# EAGLE schematic Wasp (EAGLE 6.5.0)
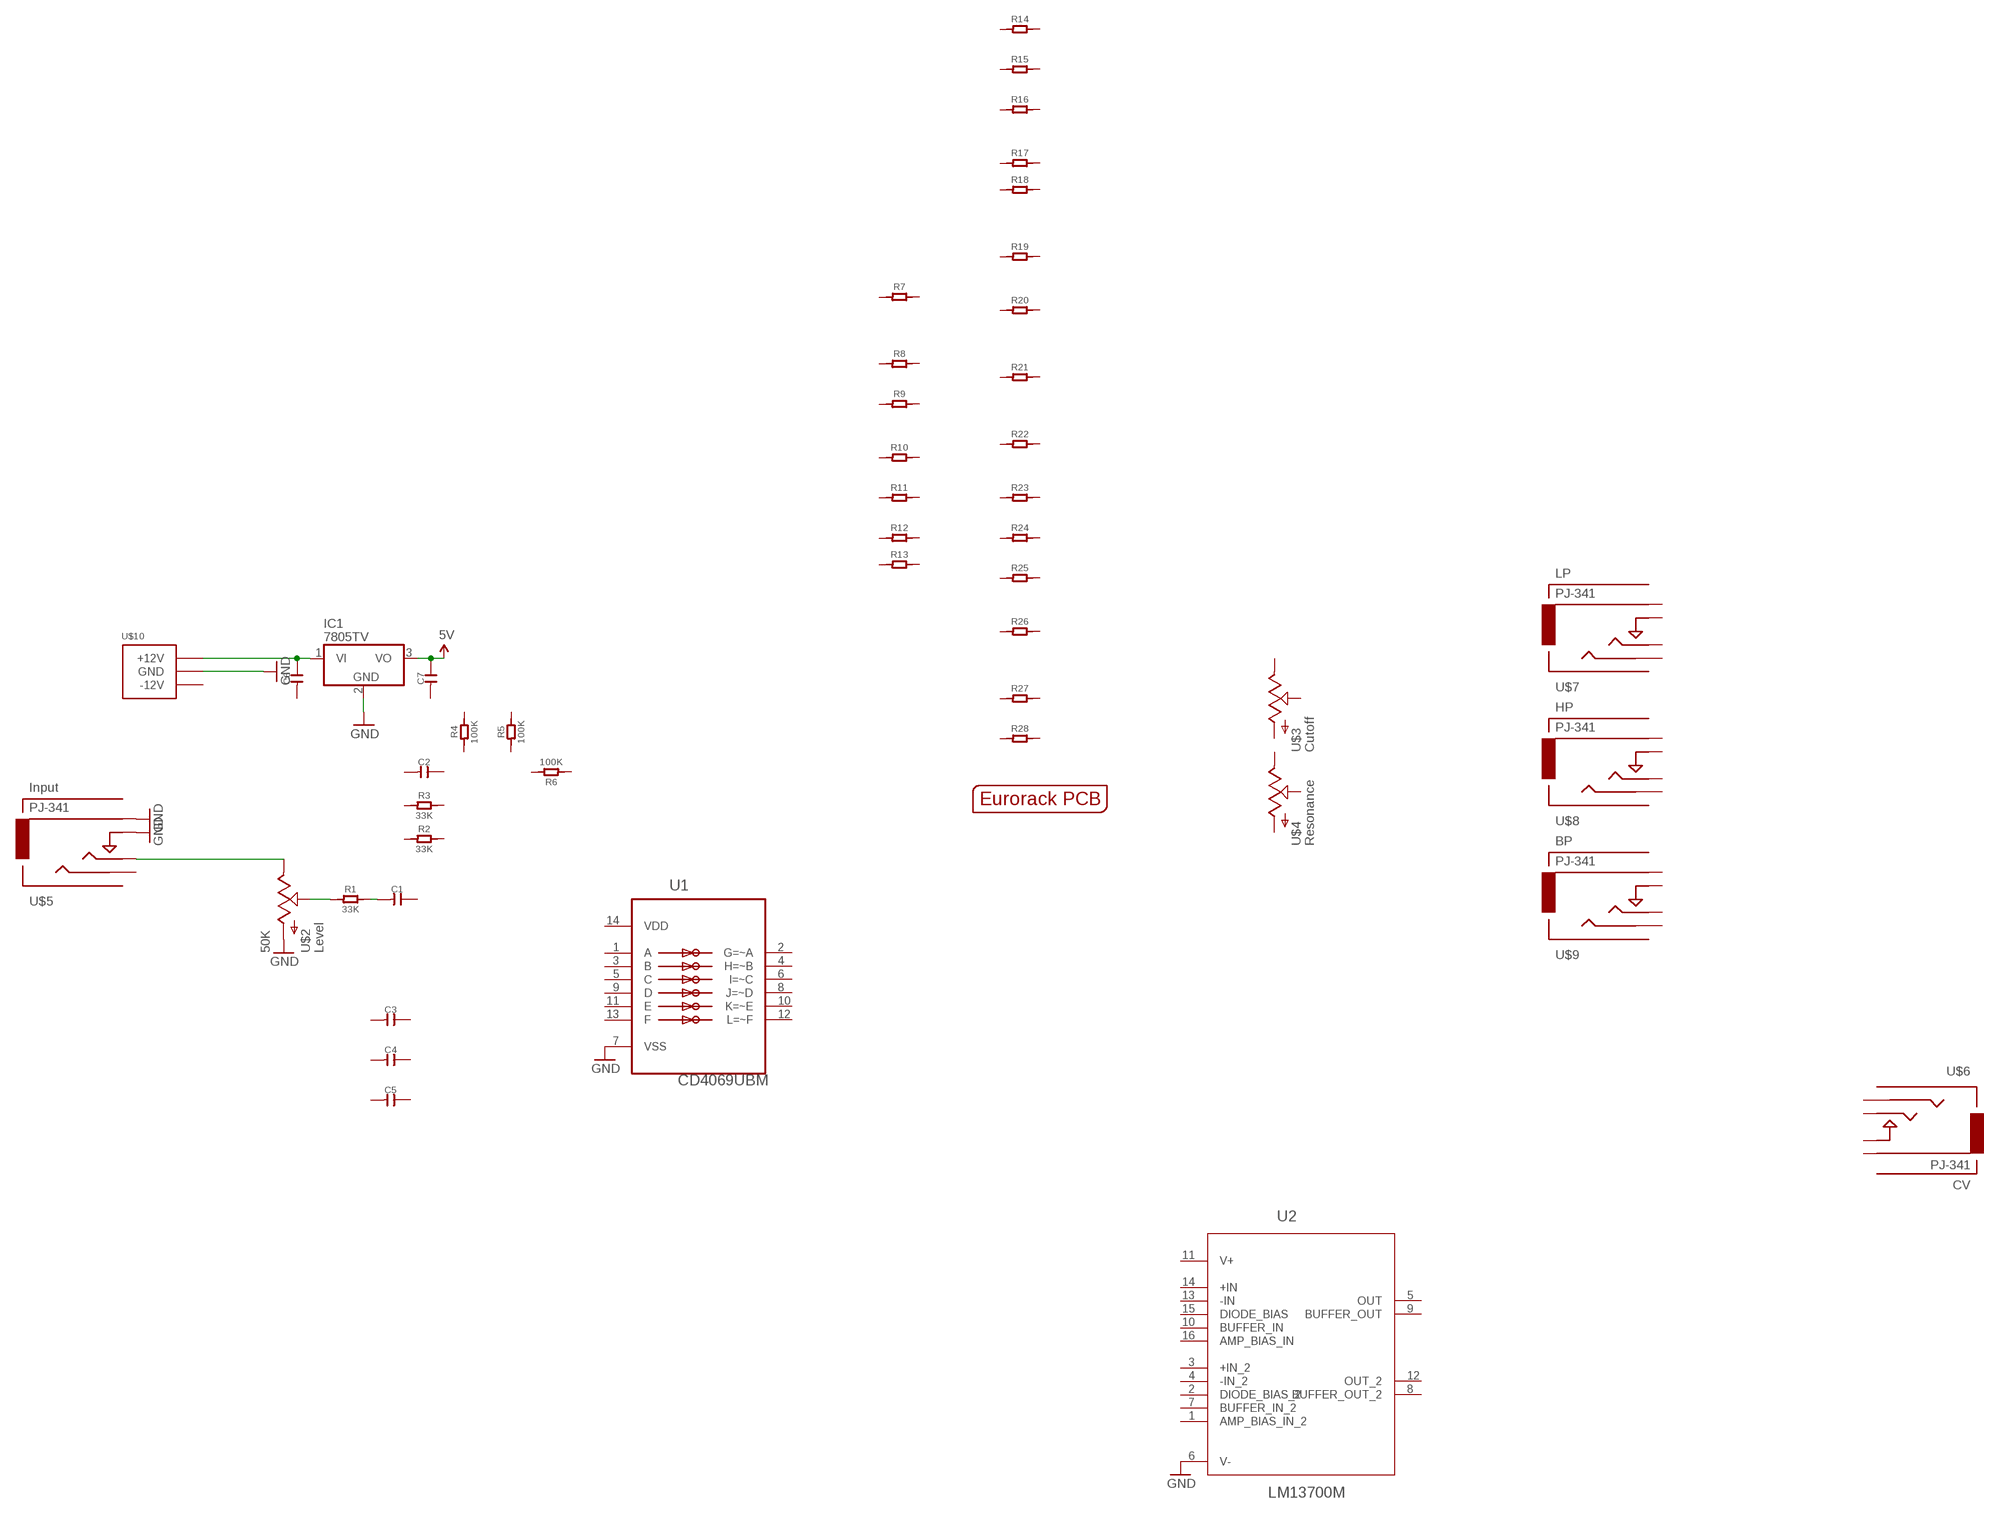
[diagram p0: schematic, sheet 1]

## Parts
C1  C-0603  [C0603]
C2  C-0603  [C0603]
C3  C-0603  [C0603]
C4  C-0603  [C0603]
C5  C-0603  [C0603]
C6  C-0603  [C0603]
C7  C-0603  [C0603]
IC1  7805TV  [TO220V]
R1  33K  R-0603  [R0603]
R2  33K  R-0603  [R0603]
R3  33K  R-0603  [R0603]
R4  100K  R-0603  [R0603]
R5  100K  R-0603  [R0603]
R6  100K  R-0603  [R0603]
R7  R-0603  [R0603]
R8  R-0603  [R0603]
R9  R-0603  [R0603]
R10  R-0603  [R0603]
R11  R-0603  [R0603]
R12  R-0603  [R0603]
R13  R-0603  [R0603]
R14  R-0603  [R0603]
R15  R-0603  [R0603]
R16  R-0603  [R0603]
R17  R-0603  [R0603]
R18  R-0603  [R0603]
R19  R-0603  [R0603]
R20  R-0603  [R0603]
R21  R-0603  [R0603]
R22  R-0603  [R0603]
R23  R-0603  [R0603]
R24  R-0603  [R0603]
R25  R-0603  [R0603]
R26  R-0603  [R0603]
R27  R-0603  [R0603]
R28  R-0603  [R0603]
U1  CD4069UBM  [SOIC127P600X175-14N]
U2  LM13700M  [SOIC127P620X175-16N]
U$1  EURORACK_PCB4HP  [EURORACK4HPPCB]
U$2  50K  POTZEPHPOT  [OG-POTS_ALPS_POT_VERTICAL]
U$3  POTZEPHPOT  [OG-POTS_ALPS_POT_VERTICAL]
U$4  POTZEPHPOT  [OG-POTS_ALPS_POT_VERTICAL]
U$5  PJ-341  AUDIO-JACKINPUT  [3.5MM-JACK-SWITCH-13MM-INPUT]
U$6  PJ-341  AUDIO-JACKINPUT  [3.5MM-JACK-SWITCH-13MM-INPUT]
U$7  PJ-341  AUDIO-JACKOUTPUT  [3.5MM-JACK-SWITCH-13MM-OUTPUT]
U$8  PJ-341  AUDIO-JACKOUTPUT  [3.5MM-JACK-SWITCH-13MM-OUTPUT]
U$9  PJ-341  AUDIO-JACKOUTPUT  [3.5MM-JACK-SWITCH-13MM-OUTPUT]
U$10  POWER_SIMPLE10  [POWER_10]

## Nets
5V: C7.2 IC1.3(VO)
GND: IC1.2(GND) U1.7(VSS) U2.6(V-) U$2.P$3(A) U$5.RING@3(RING) U$5.SWITCH@3(SWITCH) U$10.3(GND) U$10.4(GND) U$10.5(GND) U$10.6(GND) U$10.7(GND) U$10.8(GND)
N$1: R1.1 U$2.P$2(S)
N$2: U$2.P$1(E) U$5.TIP@3(TIP)
N$3: C6.2 IC1.1(VI) U$10.9(+12V) U$10.10(+12V)
N$4: C1.1 R1.2
Unconnected: C1.2 C2.1 C2.2 C3.1 C3.2 C4.1 C4.2 C5.1 C5.2 C6.1 C7.1 R2.1 R2.2 R3.1 R3.2 R4.1 R4.2 R5.1 R5.2 R6.1 R6.2 R7.1 R7.2 R8.1 R8.2 R9.1 R9.2 R10.1 R10.2 R11.1 R11.2 R12.1 R12.2 R13.1 R13.2 R14.1 R14.2 R15.1 R15.2 R16.1 R16.2 R17.1 R17.2 R18.1 R18.2 R19.1 R19.2 R20.1 R20.2 R21.1 R21.2 R22.1 R22.2 R23.1 R23.2 R24.1 R24.2 R25.1 R25.2 R26.1 R26.2 R27.1 R27.2 R28.1 R28.2 U1.1(A) U1.2(G=~A) U1.3(B) U1.4(H=~B) U1.5(C) U1.6(I=~C) U1.8(J=~D) U1.9(D) U1.10(K=~E) U1.11(E) U1.12(L=~F) U1.13(F) U2.1(AMP_BIAS_IN_2) U2.2(DIODE_BIAS_2) U2.3(+IN_2) U2.4(-IN_2) U2.5(OUT) U2.7(BUFFER_IN_2) U2.8(BUFFER_OUT_2) U2.9(BUFFER_OUT) U2.10(BUFFER_IN) U2.12(OUT_2) U2.13(-IN) U2.14(+IN) U2.15(DIODE_BIAS) U2.16(AMP_BIAS_IN) U$3.P$1(E) U$3.P$2(S) U$3.P$3(A) U$4.P$1(E) U$4.P$2(S) U$4.P$3(A) U$5.SECOND@3(SECOND) U$6.RING@3(RING) U$6.SECOND@3(SECOND) U$6.SWITCH@3(SWITCH) U$6.TIP@3(TIP) U$7.RING@3(RING) U$7.SECOND@3(SECOND) U$7.SWITCH@3(SWITCH) U$7.TIP@3(TIP) U$8.RING@3(RING) U$8.SECOND@3(SECOND) U$8.SWITCH@3(SWITCH) U$8.TIP@3(TIP) U$9.RING@3(RING) U$9.SECOND@3(SECOND) U$9.SWITCH@3(SWITCH) U$9.TIP@3(TIP) U$10.1(-12V) U$10.2(-12V)

## Power pins joined to a net without a drawn wire
V+: U2.11(V+)
VDD: U1.14(VDD)

## Library data of the parts
C1-C7 = OPL:C*
IC1 = linear:78*: Positive VOLTAGE REGULATOR Source: http://cache.national.com/ds/LM/LM78L05.pdf http://www.fairchildsemi.com/ds/LM/LM7805.pdf
R1-R28 = OPL:R*
U1 = FarnellThings:CD4069UBM: CMOS HEX Inverter; MPN: CD4069UBM; OC_FARNELL: 1607751; OC_NEWARK: 76K1022; PACKAGE: SOIC-14; SUPPLIER: Texas Instruments
U2 = FarnellThings:LM13700M: Dual Operational Transconductance Amplifiers; MPN: LM13700M; OC_FARNELL: 1468910; OC_NEWARK: 41K3505; PACKAGE: SOIC-16; SUPPLIER: National Semiconductor
U$1 = EurorackModularParts:EURORACK_PCB
U$2 = EurorackModularParts:POT; DESC: Level
U$3 = EurorackModularParts:POT; DESC: Cutoff
U$4 = EurorackModularParts:POT; DESC: Resonance
U$5 = EurorackModularParts:AUDIO-JACK: Switching Mono 3.5mm Audio Jack from Erthenvar.; DESC: Input; MPN: PJ-341
U$6 = EurorackModularParts:AUDIO-JACK: Switching Mono 3.5mm Audio Jack from Erthenvar.; DESC: CV; MPN: PJ-341
U$7 = EurorackModularParts:AUDIO-JACK: Switching Mono 3.5mm Audio Jack from Erthenvar.; DESC: LP; MPN: PJ-341
U$8 = EurorackModularParts:AUDIO-JACK: Switching Mono 3.5mm Audio Jack from Erthenvar.; DESC: HP; MPN: PJ-341
U$9 = EurorackModularParts:AUDIO-JACK: Switching Mono 3.5mm Audio Jack from Erthenvar.; DESC: BP; MPN: PJ-341
U$10 = EurorackModularParts:POWER_SIMPLE